# Altium schematic sheet 14-AM64x-03.SchDoc
size B; SheetNumber: 14; SheetTotal: 25
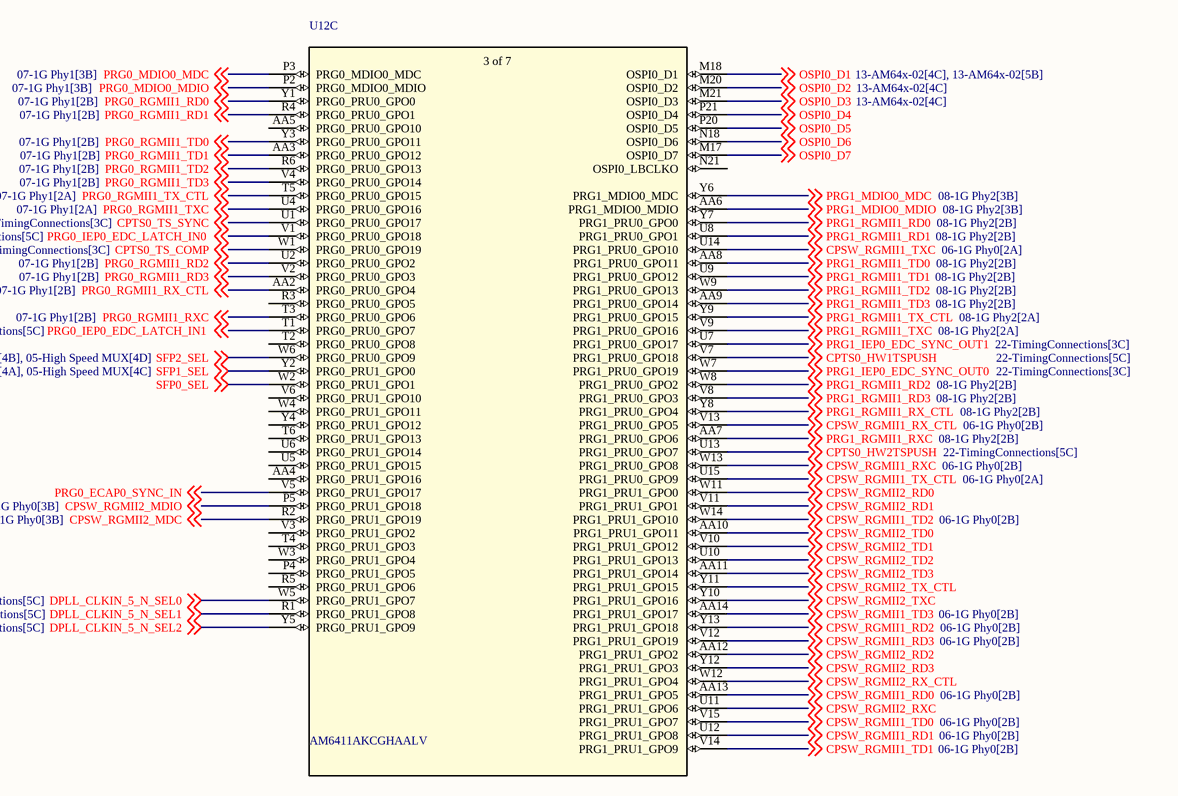
[diagram p0: 14-AM64x-03.SchDoc]

## Parts
U12  AM6411AKCGHAALV  [FCBGA441_ALV_TEX]  (part C of 7)

## Nets
CPSW_RGMII1_RD0: U12.AA13(PRG1_PRU1_GPO5) ; off-sheet CPSW_RGMII1_RD0
CPSW_RGMII1_RD1: U12.U12(PRG1_PRU1_GPO8) ; off-sheet CPSW_RGMII1_RD1
CPSW_RGMII1_RD2: U12.Y13(PRG1_PRU1_GPO18) ; off-sheet CPSW_RGMII1_RD2
CPSW_RGMII1_RD3: U12.V12(PRG1_PRU1_GPO19) ; off-sheet CPSW_RGMII1_RD3
CPSW_RGMII1_RX_CTL: U12.V13(PRG1_PRU0_GPO5) ; off-sheet CPSW_RGMII1_RX_CTL
CPSW_RGMII1_RXC: U12.W13(PRG1_PRU0_GPO8) ; off-sheet CPSW_RGMII1_RXC
CPSW_RGMII1_TD0: U12.V15(PRG1_PRU1_GPO7) ; off-sheet CPSW_RGMII1_TD0
CPSW_RGMII1_TD1: U12.V14(PRG1_PRU1_GPO9) ; off-sheet CPSW_RGMII1_TD1
CPSW_RGMII1_TD2: U12.W14(PRG1_PRU1_GPO10) ; off-sheet CPSW_RGMII1_TD2
CPSW_RGMII1_TD3: U12.AA14(PRG1_PRU1_GPO17) ; off-sheet CPSW_RGMII1_TD3
CPSW_RGMII1_TX_CTL: U12.U15(PRG1_PRU0_GPO9) ; off-sheet CPSW_RGMII1_TX_CTL
CPSW_RGMII1_TXC: U12.U14(PRG1_PRU0_GPO10) ; off-sheet CPSW_RGMII1_TXC
CPSW_RGMII2_MDC: U12.R2(PRG0_PRU1_GPO19) ; off-sheet CPSW_RGMII2_MDC
CPSW_RGMII2_MDIO: U12.P5(PRG0_PRU1_GPO18) ; off-sheet CPSW_RGMII2_MDIO
CPSW_RGMII2_RD0: U12.W11(PRG1_PRU1_GPO0) ; off-sheet CPSW_RGMII2_RD0
CPSW_RGMII2_RD1: U12.V11(PRG1_PRU1_GPO1) ; off-sheet CPSW_RGMII2_RD1
CPSW_RGMII2_RD2: U12.AA12(PRG1_PRU1_GPO2) ; off-sheet CPSW_RGMII2_RD2
CPSW_RGMII2_RD3: U12.Y12(PRG1_PRU1_GPO3) ; off-sheet CPSW_RGMII2_RD3
CPSW_RGMII2_RX_CTL: U12.W12(PRG1_PRU1_GPO4) ; off-sheet CPSW_RGMII2_RX_CTL
CPSW_RGMII2_RXC: U12.U11(PRG1_PRU1_GPO6) ; off-sheet CPSW_RGMII2_RXC
CPSW_RGMII2_TD0: U12.AA10(PRG1_PRU1_GPO11) ; off-sheet CPSW_RGMII2_TD0
CPSW_RGMII2_TD1: U12.V10(PRG1_PRU1_GPO12) ; off-sheet CPSW_RGMII2_TD1
CPSW_RGMII2_TD2: U12.U10(PRG1_PRU1_GPO13) ; off-sheet CPSW_RGMII2_TD2
CPSW_RGMII2_TD3: U12.AA11(PRG1_PRU1_GPO14) ; off-sheet CPSW_RGMII2_TD3
CPSW_RGMII2_TX_CTL: U12.Y11(PRG1_PRU1_GPO15) ; off-sheet CPSW_RGMII2_TX_CTL
CPSW_RGMII2_TXC: U12.Y10(PRG1_PRU1_GPO16) ; off-sheet CPSW_RGMII2_TXC
CPTS0_HW1TSPUSH: U12.V7(PRG1_PRU0_GPO18) ; off-sheet CPTS0_HW1TSPUSH
CPTS0_HW2TSPUSH: U12.U13(PRG1_PRU0_GPO7) ; off-sheet CPTS0_HW2TSPUSH
CPTS0_TS_COMP: U12.W1(PRG0_PRU0_GPO19) ; off-sheet CPTS0_TS_COMP
CPTS0_TS_SYNC: U12.U1(PRG0_PRU0_GPO17) ; off-sheet CPTS0_TS_SYNC
DPLL_CLKIN_5_N_SEL0: U12.W5(PRG0_PRU1_GPO7) ; off-sheet DPLL_CLKIN_5_N_SEL0
DPLL_CLKIN_5_N_SEL1: U12.R1(PRG0_PRU1_GPO8) ; off-sheet DPLL_CLKIN_5_N_SEL1
DPLL_CLKIN_5_N_SEL2: U12.Y5(PRG0_PRU1_GPO9) ; off-sheet DPLL_CLKIN_5_N_SEL2
OSPI0_D1: U12.M18(OSPI0_D1) ; off-sheet OSPI0_D1
OSPI0_D2: U12.M20(OSPI0_D2) ; off-sheet OSPI0_D2
OSPI0_D3: U12.M21(OSPI0_D3) ; off-sheet OSPI0_D3
OSPI0_D4: U12.P21(OSPI0_D4) ; off-sheet OSPI0_D4
OSPI0_D5: U12.P20(OSPI0_D5) ; off-sheet OSPI0_D5
OSPI0_D6: U12.N18(OSPI0_D6) ; off-sheet OSPI0_D6
OSPI0_D7: U12.M17(OSPI0_D7) ; off-sheet OSPI0_D7
PRG0_ECAP0_SYNC_IN: U12.V5(PRG0_PRU1_GPO17) ; off-sheet PRG0_ECAP0_SYNC_IN
PRG0_IEP0_EDC_LATCH_IN0 : U12.V1(PRG0_PRU0_GPO18) ; off-sheet PRG0_IEP0_EDC_LATCH_IN0 
PRG0_IEP0_EDC_LATCH_IN1 : U12.T1(PRG0_PRU0_GPO7) ; off-sheet PRG0_IEP0_EDC_LATCH_IN1 
PRG0_MDIO0_MDC: U12.P3(PRG0_MDIO0_MDC) ; off-sheet PRG0_MDIO0_MDC
PRG0_MDIO0_MDIO: U12.P2(PRG0_MDIO0_MDIO) ; off-sheet PRG0_MDIO0_MDIO
PRG0_RGMII1_RD0: U12.Y1(PRG0_PRU0_GPO0) ; off-sheet PRG0_RGMII1_RD0
PRG0_RGMII1_RD1: U12.R4(PRG0_PRU0_GPO1) ; off-sheet PRG0_RGMII1_RD1
PRG0_RGMII1_RD2: U12.U2(PRG0_PRU0_GPO2) ; off-sheet PRG0_RGMII1_RD2
PRG0_RGMII1_RD3: U12.V2(PRG0_PRU0_GPO3) ; off-sheet PRG0_RGMII1_RD3
PRG0_RGMII1_RX_CTL: U12.AA2(PRG0_PRU0_GPO4) ; off-sheet PRG0_RGMII1_RX_CTL
PRG0_RGMII1_RXC: U12.T3(PRG0_PRU0_GPO6) ; off-sheet PRG0_RGMII1_RXC
PRG0_RGMII1_TD0: U12.Y3(PRG0_PRU0_GPO11) ; off-sheet PRG0_RGMII1_TD0
PRG0_RGMII1_TD1: U12.AA3(PRG0_PRU0_GPO12) ; off-sheet PRG0_RGMII1_TD1
PRG0_RGMII1_TD2: U12.R6(PRG0_PRU0_GPO13) ; off-sheet PRG0_RGMII1_TD2
PRG0_RGMII1_TD3: U12.V4(PRG0_PRU0_GPO14) ; off-sheet PRG0_RGMII1_TD3
PRG0_RGMII1_TX_CTL: U12.T5(PRG0_PRU0_GPO15) ; off-sheet PRG0_RGMII1_TX_CTL
PRG0_RGMII1_TXC: U12.U4(PRG0_PRU0_GPO16) ; off-sheet PRG0_RGMII1_TXC
PRG1_IEP0_EDC_SYNC_OUT0: U12.W7(PRG1_PRU0_GPO19) ; off-sheet PRG1_IEP0_EDC_SYNC_OUT0
PRG1_IEP0_EDC_SYNC_OUT1: U12.U7(PRG1_PRU0_GPO17) ; off-sheet PRG1_IEP0_EDC_SYNC_OUT1
PRG1_MDIO0_MDC: U12.Y6(PRG1_MDIO0_MDC) ; off-sheet PRG1_MDIO0_MDC
PRG1_MDIO0_MDIO: U12.AA6(PRG1_MDIO0_MDIO) ; off-sheet PRG1_MDIO0_MDIO
PRG1_RGMII1_RD0: U12.Y7(PRG1_PRU0_GPO0) ; off-sheet PRG1_RGMII1_RD0
PRG1_RGMII1_RD1: U12.U8(PRG1_PRU0_GPO1) ; off-sheet PRG1_RGMII1_RD1
PRG1_RGMII1_RD2: U12.W8(PRG1_PRU0_GPO2) ; off-sheet PRG1_RGMII1_RD2
PRG1_RGMII1_RD3: U12.V8(PRG1_PRU0_GPO3) ; off-sheet PRG1_RGMII1_RD3
PRG1_RGMII1_RX_CTL: U12.Y8(PRG1_PRU0_GPO4) ; off-sheet PRG1_RGMII1_RX_CTL
PRG1_RGMII1_RXC: U12.AA7(PRG1_PRU0_GPO6) ; off-sheet PRG1_RGMII1_RXC
PRG1_RGMII1_TD0: U12.AA8(PRG1_PRU0_GPO11) ; off-sheet PRG1_RGMII1_TD0
PRG1_RGMII1_TD1: U12.U9(PRG1_PRU0_GPO12) ; off-sheet PRG1_RGMII1_TD1
PRG1_RGMII1_TD2: U12.W9(PRG1_PRU0_GPO13) ; off-sheet PRG1_RGMII1_TD2
PRG1_RGMII1_TD3: U12.AA9(PRG1_PRU0_GPO14) ; off-sheet PRG1_RGMII1_TD3
PRG1_RGMII1_TX_CTL: U12.Y9(PRG1_PRU0_GPO15) ; off-sheet PRG1_RGMII1_TX_CTL
PRG1_RGMII1_TXC: U12.V9(PRG1_PRU0_GPO16) ; off-sheet PRG1_RGMII1_TXC
SFP0_SEL: U12.W2(PRG0_PRU1_GPO1) ; off-sheet SFP0_SEL
SFP1_SEL: U12.Y2(PRG0_PRU1_GPO0) ; off-sheet SFP1_SEL
SFP2_SEL: U12.W6(PRG0_PRU0_GPO9) ; off-sheet SFP2_SEL

Not connected (* = marked no-connect by the designer): U12 AA4(PRG0_PRU1_GPO16) AA5(PRG0_PRU0_GPO10) N21(OSPI0_LBCLKO) P4(PRG0_PRU1_GPO5) R3(PRG0_PRU0_GPO5) R5(PRG0_PRU1_GPO6) T2(PRG0_PRU0_GPO8) T4(PRG0_PRU1_GPO3) T6(PRG0_PRU1_GPO13) U5(PRG0_PRU1_GPO15) U6(PRG0_PRU1_GPO14) V3(PRG0_PRU1_GPO2) V6(PRG0_PRU1_GPO10) W3(PRG0_PRU1_GPO4) W4(PRG0_PRU1_GPO11) Y4(PRG0_PRU1_GPO12)

## Notes on the sheet
- (in symbol AM6411AKCGHAALV, part C) 3 of 7

## Library data of the parts
U12 = AM6411AKCGHAALV: No Description Available; Mfr_Name: Texas Instruments; RefDes: RefDes; Type: Type